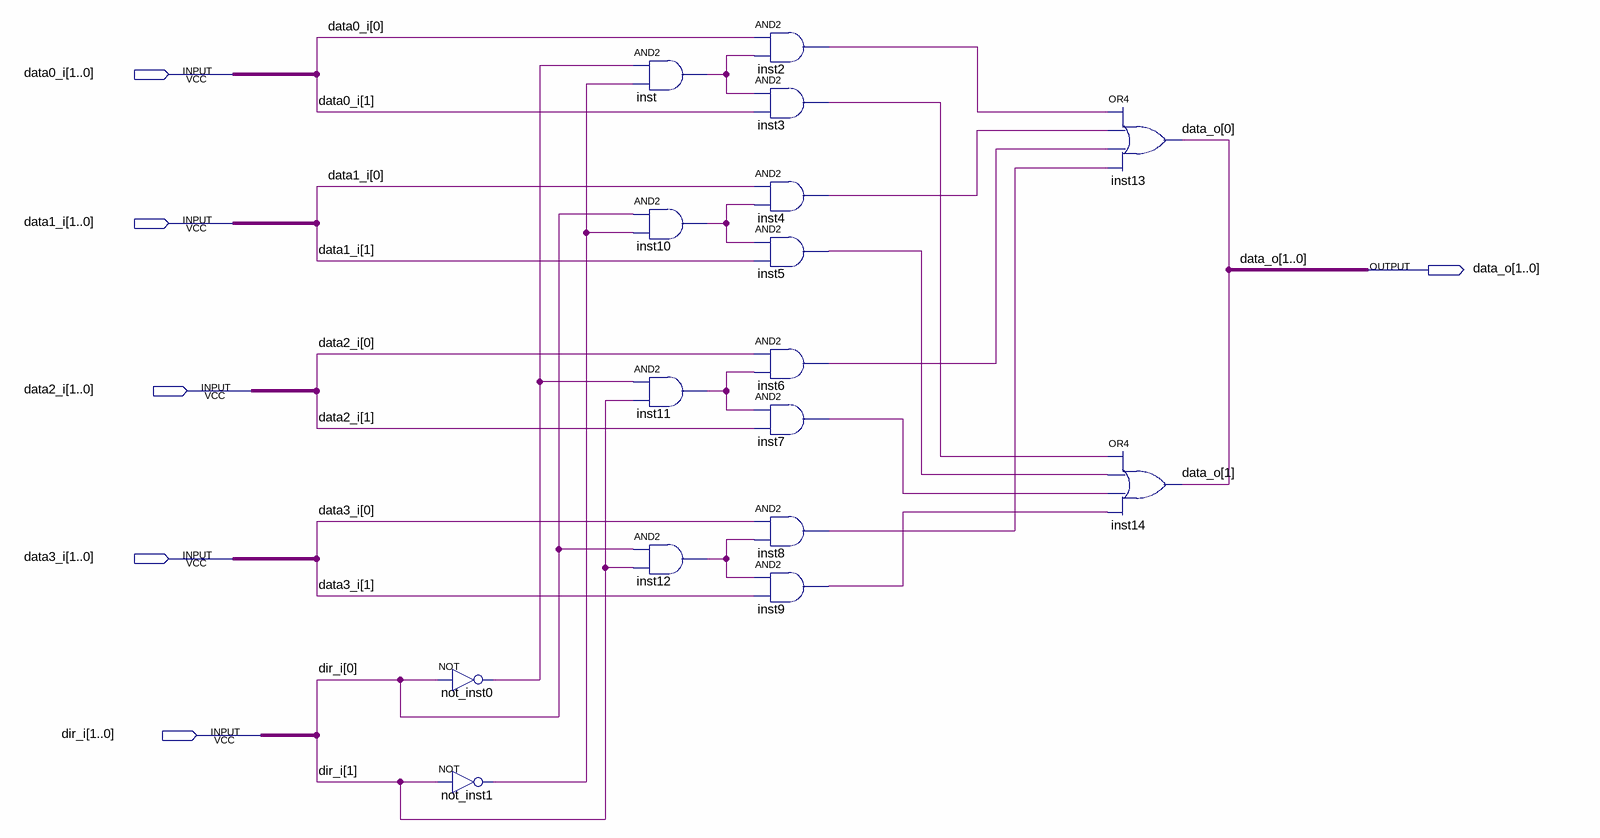
[diagram p0: schematic sheet]
// Quartus schematic mux4.bdf as structural Verilog: 16 symbols, 6 pins
module mux4 (
  input  [1:0] data0_i,
  input  [1:0] data1_i,
  input  [1:0] data2_i,
  input  [1:0] data3_i,
  input  [1:0] dir_i,
  output [1:0] data_o
);

  wire inst2_out, inst3_out, inst4_out, inst5_out, inst6_out, inst7_out, inst8_out, inst9_out, inst10_out,
       inst11_out, inst12_out, inst_out, not_inst0_out, not_inst1_out;

  not not_inst0 (not_inst0_out, dir_i[0]);
  not not_inst1 (not_inst1_out, dir_i[1]);
  and inst (inst_out, not_inst0_out, not_inst1_out);
  and inst10 (inst10_out, dir_i[0], not_inst1_out);
  and inst11 (inst11_out, not_inst0_out, dir_i[1]);
  and inst12 (inst12_out, dir_i[0], dir_i[1]);
  and inst2 (inst2_out, data0_i[0], inst_out);
  and inst3 (inst3_out, inst_out, data0_i[1]);
  and inst4 (inst4_out, data1_i[0], inst10_out);
  and inst5 (inst5_out, inst10_out, data1_i[1]);
  and inst6 (inst6_out, data2_i[0], inst11_out);
  and inst7 (inst7_out, inst11_out, data2_i[1]);
  and inst8 (inst8_out, data3_i[0], inst12_out);
  and inst9 (inst9_out, inst12_out, data3_i[1]);
  or inst13 (data_o[0], inst2_out, inst4_out, inst6_out, inst8_out);
  or inst14 (data_o[1], inst3_out, inst5_out, inst7_out, inst9_out);
endmodule
